# Altium schematic sheet Motors.SchDoc
size Letter; DocumentNumber: 3; SheetNumber: 3; SheetTotal: 5
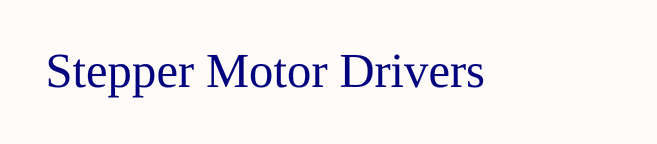
[diagram p0: Motors.SchDoc]

## Notes on the sheet
- Stepper Motor Drivers